# EAGLE schematic ElektorLinuxBoard_V3.01 (EAGLE 6.4)

## Sheet 1 of 3
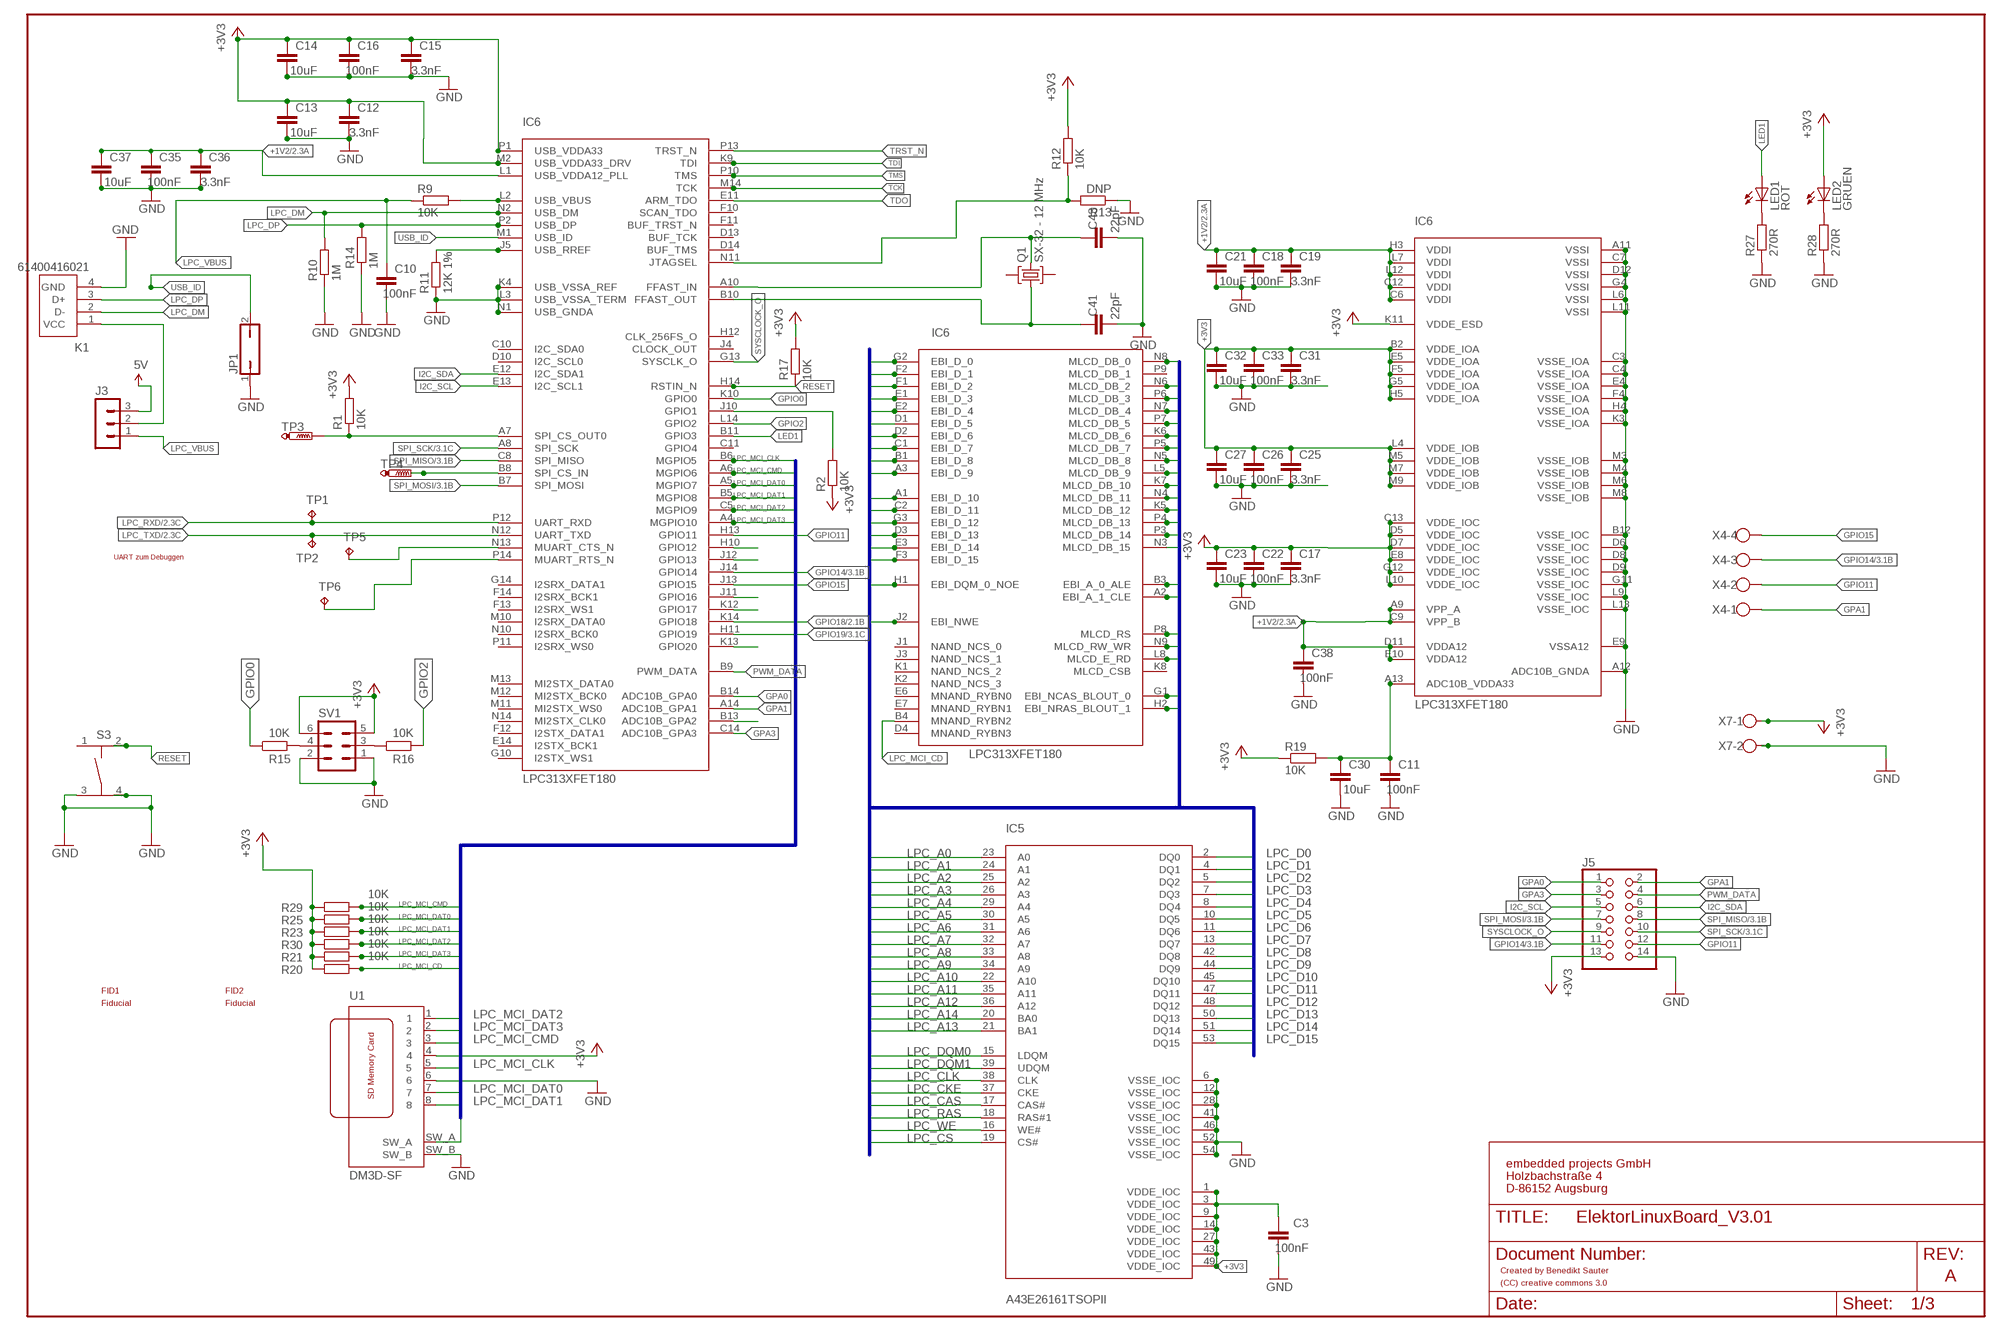
[diagram p0: schematic, sheet 1]

### Parts
C3  100nF  C-EUC0805  [C0805]
C10  100nF  C-EUC0805  [C0805]
C11  100nF  C-EUC0805  [C0805]
C12  3.3nF  C-EUC0805  [C0805]
C13  10uF  C-EUC0805  [C0805]
C14  10uF  C-EUC0805  [C0805]
C15  3.3nF  C-EUC0805  [C0805]
C16  100nF  C-EUC0805  [C0805]
C17  3.3nF  C-EUC0805  [C0805]
C18  100nF  C-EUC0805  [C0805]
C19  3.3nF  C-EUC0805  [C0805]
C21  10uF  C-EUC0805  [C0805]
C22  100nF  C-EUC0805  [C0805]
C23  10uF  C-EUC0805  [C0805]
C25  3.3nF  C-EUC0805  [C0805]
C26  100nF  C-EUC0805  [C0805]
C27  10uF  C-EUC0805  [C0805]
C30  10uF  C-EUC0805  [C0805]
C31  3.3nF  C-EUC0805  [C0805]
C32  10uF  C-EUC0805  [C0805]
C33  100nF  C-EUC0805  [C0805]
C35  100nF  C-EUC0805  [C0805]
C36  3.3nF  C-EUC0805  [C0805]
C37  10uF  C-EUC0805  [C0805]
C38  100nF  C-EUC0805  [C0805]
C41  22pF  C-EUC0805  [C0805]
C43  22pF  C-EUC0805  [C0805]
FID1  PASSERMARKEN_FIDUCIAL  [PASSERMARKEN_FIDUCIAL]
FID2  PASSERMARKEN_FIDUCIAL  [PASSERMARKEN_FIDUCIAL]
IC5  A43E26161TSOPII  [TSOPII]
IC6  LPC313XFET180  [TFBGA180]
J3  MA03-1  [MA03-1]
J5  PINHD-2X7  [2X07]
JP1  JP1Q  [JP1]
K1  61400416021  [61400416021]
LED1  ROT  LEDCHIP-LED0805  [CHIP-LED0805]
LED2  GRUEN  LEDCHIP-LED0805  [CHIP-LED0805]
Q1  SX-32 - 12 MHz  SX-32  [SX-32]
R1  10K  R-EU_R0805  [R0805]
R2  10K  R-EU_R0805  [R0805]
R9  10K  R-EU_R0805  [R0805]
R10  1M  R-EU_R0805  [R0805]
R11  12K 1%  R-EU_R0805  [R0805]
R12  10K  R-EU_R0805  [R0805]
R13  DNP  R-EU_R0805  [R0805]
R14  1M  R-EU_R0805  [R0805]
R15  10K  R-EU_R0805  [R0805]
R16  10K  R-EU_R0805  [R0805]
R17  10K  R-EU_R0805  [R0805]
R19  10K  R-EU_R0805  [R0805]
R20  10K  R-EU_R0805  [R0805]
R21  10K  R-EU_R0805  [R0805]
R23  10K  R-EU_R0805  [R0805]
R25  10K  R-EU_R0805  [R0805]
R27  270R  R-EU_R0805  [R0805]
R28  270R  R-EU_R0805  [R0805]
R29  10K  R-EU_R0805  [R0805]
R30  10K  R-EU_R0805  [R0805]
S3  TASTER-9314_SMD  [TASTER-9314_SMD]
SV1  MA03-2  [MA03-2]
TP1  TPTP15R  [TP15R]
TP2  TPTP15R  [TP15R]
TP3  PTR1TP08R  [TP08R]
TP4  PTR1TP08R  [TP08R]
TP5  TPTP08R  [TP08R]
TP6  TPTP08R  [TP08R]
U1  DM3D-SF  [DM3D-SF]
X4  W237-04P  [W237-4P]
X7  W237-02P  [W237-132]

### Nets
5V [500mA]: J3.3 ; also sheet 2
+1V2: C18.2 C19.2 C21.2 C35.2 C36.2 C37.2 C38.2 IC6.A9(VPP_A) IC6.C6(VDDI) IC6.C9(VPP_B) IC6.C12(VDDI) IC6.D11(VDDA12) IC6.E10(VDDA12) IC6.H3(VDDI) IC6.L1(USB_VDDA12_PLL) IC6.L7(VDDI) IC6.L12(VDDI) ; also sheet 2
+3V3: C3.2 C12.2 C13.2 C14.2 C15.2 C16.2 C17.2 C22.2 C23.2 C25.2 C26.2 C27.2 C31.2 C32.2 C33.2 IC5.1(VDDE_IOC) IC5.3(VDDE_IOC) IC5.9(VDDE_IOC) IC5.14(VDDE_IOC) IC5.27(VDDE_IOC) IC5.43(VDDE_IOC) IC5.49(VDDE_IOC) IC6.B2(VDDE_IOA) IC6.C13(VDDE_IOC) IC6.D5(VDDE_IOC) IC6.D7(VDDE_IOC) IC6.E5(VDDE_IOA) IC6.E8(VDDE_IOC) IC6.F5(VDDE_IOA) IC6.G5(VDDE_IOA) IC6.G12(VDDE_IOC) IC6.H5(VDDE_IOA) IC6.K11(VDDE_ESD) IC6.L4(VDDE_IOB) IC6.L10(VDDE_IOC) IC6.M2(USB_VDDA33_DRV) IC6.M5(VDDE_IOB) IC6.M7(VDDE_IOB) IC6.M9(VDDE_IOB) IC6.P1(USB_VDDA33) J5.13 LED2.A R1.2 R2.1 R12.2 R17.2 R19.1 R20.1 R21.1 R23.1 R25.1 R29.1 R30.1 SV1.5 SV1.6 U1.4 X7.1 ; also sheet 2,3
GND: C3.1 C10.1 C11.1 C12.1 C13.1 C14.1 C15.1 C16.1 C17.1 C18.1 C19.1 C21.1 C22.1 C23.1 C25.1 C26.1 C27.1 C30.1 C31.1 C32.1 C33.1 C35.1 C36.1 C37.1 C38.1 C41.1 C43.1 IC5.6(VSSE_IOC) IC5.12(VSSE_IOC) IC5.28(VSSE_IOC) IC5.41(VSSE_IOC) IC5.46(VSSE_IOC) IC5.52(VSSE_IOC) IC5.54(VSSE_IOC) IC6.A11(VSSI) IC6.A12(ADC10B_GNDA) IC6.B12(VSSE_IOC) IC6.C3(VSSE_IOA) IC6.C4(VSSE_IOA) IC6.C7(VSSI) IC6.D6(VSSE_IOC) IC6.D8(VSSE_IOC) IC6.D9(VSSE_IOC) IC6.D12(VSSI) IC6.E4(VSSE_IOA) IC6.E9(VSSA12) IC6.F4(VSSE_IOA) IC6.G4(VSSI) IC6.G11(VSSE_IOC) IC6.H4(VSSE_IOA) IC6.K3(VSSE_IOA) IC6.K4(USB_VSSA_REF) IC6.L3(USB_VSSA_TERM) IC6.L6(VSSI) IC6.L9(VSSE_IOC) IC6.L11(VSSI) IC6.L13(VSSE_IOC) IC6.M3(VSSE_IOB) IC6.M4(VSSE_IOB) IC6.M6(VSSE_IOB) IC6.M8(VSSE_IOB) IC6.N1(USB_GNDA) J5.14 JP1.1 K1.4(GND) R10.1 R11.1 R13.1 R14.1 R27.1 R28.1 S3.3 S3.4 SV1.1 SV1.2 U1.6 U1.SW_B X7.2 ; also sheet 2,3
GPA0: IC6.B14(ADC10B_GPA0) J5.1
GPA1: IC6.A14(ADC10B_GPA1) J5.2 X4.1
GPA3: IC6.C14(ADC10B_GPA3) J5.3
GPIO0: IC6.K10(GPIO0) R15.1
GPIO2: IC6.L14(GPIO2) R16.2
GPIO11: IC6.H13(GPIO11) J5.12 X4.2
GPIO14: IC6.J14(GPIO14) J5.11 X4.3 ; also sheet 3
GPIO15: IC6.J13(GPIO15) X4.4
GPIO18: IC6.K14(GPIO18) ; also sheet 2
GPIO19: IC6.H11(GPIO19) ; also sheet 3
I2C_SCL: IC6.E13(I2C_SCL1) J5.5
I2C_SDA: IC6.E12(I2C_SDA1) J5.6
LED1: IC6.B11(GPIO3) LED1.A
LPC_A0: IC5.23(A0) IC6.B3(EBI_A_0_ALE)
LPC_A1: IC5.24(A1) IC6.A2(EBI_A_1_CLE)
LPC_A2: IC5.25(A2) IC6.N6(MLCD_DB_2)
LPC_A3: IC5.26(A3) IC6.P6(MLCD_DB_3)
LPC_A4: IC5.29(A4) IC6.N7(MLCD_DB_4)
LPC_A5: IC5.30(A5) IC6.P7(MLCD_DB_5)
LPC_A6: IC5.31(A6) IC6.K6(MLCD_DB_6)
LPC_A7: IC5.32(A7) IC6.P5(MLCD_DB_7)
LPC_A8: IC5.33(A8) IC6.N5(MLCD_DB_8)
LPC_A9: IC5.34(A9) IC6.L5(MLCD_DB_9)
LPC_A10: IC5.22(A10) IC6.K7(MLCD_DB_10)
LPC_A11: IC5.35(A11) IC6.N4(MLCD_DB_11)
LPC_A12: IC5.36(A12) IC6.K5(MLCD_DB_12)
LPC_A13: IC5.21(BA1) IC6.P4(MLCD_DB_13)
LPC_A14: IC5.20(BA0) IC6.P3(MLCD_DB_14)
LPC_A15: IC6.N3(MLCD_DB_15)
LPC_CAS: IC5.17(CAS#) IC6.G1(EBI_NCAS_BLOUT_0)
LPC_CKE: IC5.37(CKE) IC6.L8(MLCD_E_RD)
LPC_CLK: IC5.38(CLK) IC6.N8(MLCD_DB_0)
LPC_CS: IC5.19(CS#) IC6.P8(MLCD_RS)
LPC_D0: IC5.2(DQ0) IC6.G2(EBI_D_0)
LPC_D1: IC5.4(DQ1) IC6.F2(EBI_D_1)
LPC_D2: IC5.5(DQ2) IC6.F1(EBI_D_2)
LPC_D3: IC5.7(DQ3) IC6.E1(EBI_D_3)
LPC_D4: IC5.8(DQ4) IC6.E2(EBI_D_4)
LPC_D5: IC5.10(DQ5) IC6.D1(EBI_D_5)
LPC_D6: IC5.11(DQ6) IC6.D2(EBI_D_6)
LPC_D7: IC5.13(DQ7) IC6.C1(EBI_D_7)
LPC_D8: IC5.42(DQ8) IC6.B1(EBI_D_8)
LPC_D9: IC5.44(DQ9) IC6.A3(EBI_D_9)
LPC_D10: IC5.45(DQ10) IC6.A1(EBI_D_10)
LPC_D11: IC5.47(DQ11) IC6.C2(EBI_D_11)
LPC_D12: IC5.48(DQ12) IC6.G3(EBI_D_12)
LPC_D13: IC5.50(DQ13) IC6.D3(EBI_D_13)
LPC_D14: IC5.51(DQ14) IC6.E3(EBI_D_14)
LPC_D15: IC5.53(DQ15) IC6.F3(EBI_D_15)
LPC_DM: IC6.N2(USB_DM) K1.2(D-) R10.2
LPC_DP: IC6.P2(USB_DP) K1.3(D+) R14.2
LPC_DQM0: IC5.15(LDQM) IC6.H1(EBI_DQM_0_NOE)
LPC_DQM1: IC5.39(UDQM) IC6.N9(MLCD_RW_WR)
LPC_MCI_CD: IC6.B4(MNAND_RYBN2) R20.2 U1.SW_A
LPC_MCI_CLK: IC6.B6(MGPIO5) U1.5
LPC_MCI_CMD: IC6.A6(MGPIO6) R29.2 U1.3
LPC_MCI_DAT0: IC6.A5(MGPIO7) R25.2 U1.7
LPC_MCI_DAT1: IC6.B5(MGPIO8) R23.2 U1.8
LPC_MCI_DAT2: IC6.C5(MGPIO9) R30.2 U1.1
LPC_MCI_DAT3: IC6.A4(MGPIO10) R21.2 U1.2
LPC_RAS: IC5.18(RAS#1) IC6.H2(EBI_NRAS_BLOUT_1)
LPC_RXD: IC6.P12(UART_RXD) TP1.TP ; also sheet 2
LPC_TXD: IC6.N12(UART_TXD) TP2.TP ; also sheet 2
LPC_VBUS: C10.2 J3.1 R9.1
LPC_WE: IC5.16(WE#) IC6.J2(EBI_NWE)
N$3: LED1.C R27.2
N$7: LED2.C R28.2
N$9: IC6.N11(JTAGSEL) R12.1 R13.2
N$10: J3.2 K1.1(VCC)
N$16: IC6.K13(GPIO20)
N$18: IC6.A7(SPI_CS_OUT0) R1.1 TP3.TP
N$19: IC6.B8(SPI_CS_IN) TP4.TP
N$20: IC6.K12(GPIO17)
N$21: IC6.J11(GPIO16)
N$22: IC6.B13(ADC10B_GPA2)
N$24: IC6.J12(GPIO13)
N$25: IC6.H10(GPIO12)
N$26: IC6.J10(GPIO1) R2.2
N$27: R15.2 SV1.4
N$28: R16.1 SV1.3
N$29: IC6.N13(MUART_CTS_N) TP5.TP
N$30: IC6.P14(MUART_RTS_N) TP6.TP
N$44: C11.2 C30.2 IC6.A13(ADC10B_VDDA33) R19.2
N$54: IC6.J5(USB_RREF) R11.2
N$57: IC6.L2(USB_VBUS) R9.2
PWM_DATA: IC6.B9(PWM_DATA) J5.4
RESET: IC6.H14(RSTIN_N) R17.1 S3.2
SPI_MISO: IC6.C8(SPI_MISO) J5.8 ; also sheet 3
SPI_MOSI: IC6.B7(SPI_MOSI) J5.7 ; also sheet 3
SPI_SCK: IC6.A8(SPI_SCK) J5.10 ; also sheet 3
SYSCLOCK_O: IC6.G13(SYSCLK_O) J5.9
TCK: IC6.M14(TCK)
TDI: IC6.K9(TDI)
TDO: IC6.E11(ARM_TDO)
TMS: IC6.P10(TMS)
TRST_N: IC6.P13(TRST_N)
USB_ID: IC6.M1(USB_ID) JP1.2
XTAL1: C43.2 IC6.A10(FFAST_IN) Q1.3
XTAL2: C41.2 IC6.B10(FFAST_OUT) Q1.1
Unconnected: IC6.C10(I2C_SDA0) IC6.C11(GPIO4) IC6.D4(MNAND_RYBN3) IC6.D10(I2C_SCL0) IC6.D13(BUF_TCK) IC6.D14(BUF_TMS) IC6.E6(MNAND_RYBN0) IC6.E7(MNAND_RYBN1) IC6.E14(I2STX_BCK1) IC6.F10(SCAN_TDO) IC6.F11(BUF_TRST_N) IC6.F12(I2STX_DATA1) IC6.F13(I2SRX_WS1) IC6.F14(I2SRX_BCK1) IC6.G10(I2STX_WS1) IC6.G14(I2SRX_DATA1) IC6.H12(CLK_256FS_O) IC6.J1(NAND_NCS_0) IC6.J3(NAND_NCS_1) IC6.J4(CLOCK_OUT) IC6.K1(NAND_NCS_2) IC6.K2(NAND_NCS_3) IC6.K8(MLCD_CSB) IC6.M10(I2SRX_DATA0) IC6.M11(MI2STX_WS0) IC6.M12(MI2STX_BCK0) IC6.M13(MI2STX_DATA0) IC6.N10(I2SRX_BCK0) IC6.N14(MI2STX_CLK0) IC6.P9(MLCD_DB_1) IC6.P11(I2SRX_WS0) Q1.2 Q1.4 S3.1

### Buses
B3:LPC_D0,LPC_D1,LPC_D2,LPC_D3,LPC_D4,LPC_D5,LPC_D6,LPC_D7,LPC_D8,LPC_D9,LPC_D10,LPC_D11,LPC_D12,LPC_D13,LPC_D14,LPC_D15,LPC_A0,LPC_A1,LPC_A2,LPC_A3,LPC_A4,LPC_A5,LPC_A6,LPC_A7,LPC_A8,LPC_A9,LPC_A10,LPC_A11,LPC_A12,LPC_A13,LPC_A14,LPC_A15,LPC_CKE,LPC_CS,LPC_DQM1,LPC_CLK,LPC_RAS,LPC_CAS,LPC_DQM0,LPC_WE
B5:LPC_MCI_CLK,LPC_MCI_CMD,LPC_MCI_DAT0,LPC_MCI_DAT1,LPC_MCI_DAT2,LPC_MCI_DAT3,LPC_MCI_CD,LPC_MCI_WP

### Notes on the sheet
- UART zum Debuggen
- embedded projects GmbH
- Holzbachstraße 4
- D-86152 Augsburg
- Created by Benedikt Sauter
- A
- (CC) creative commons 3.0

## Sheet 2 of 3
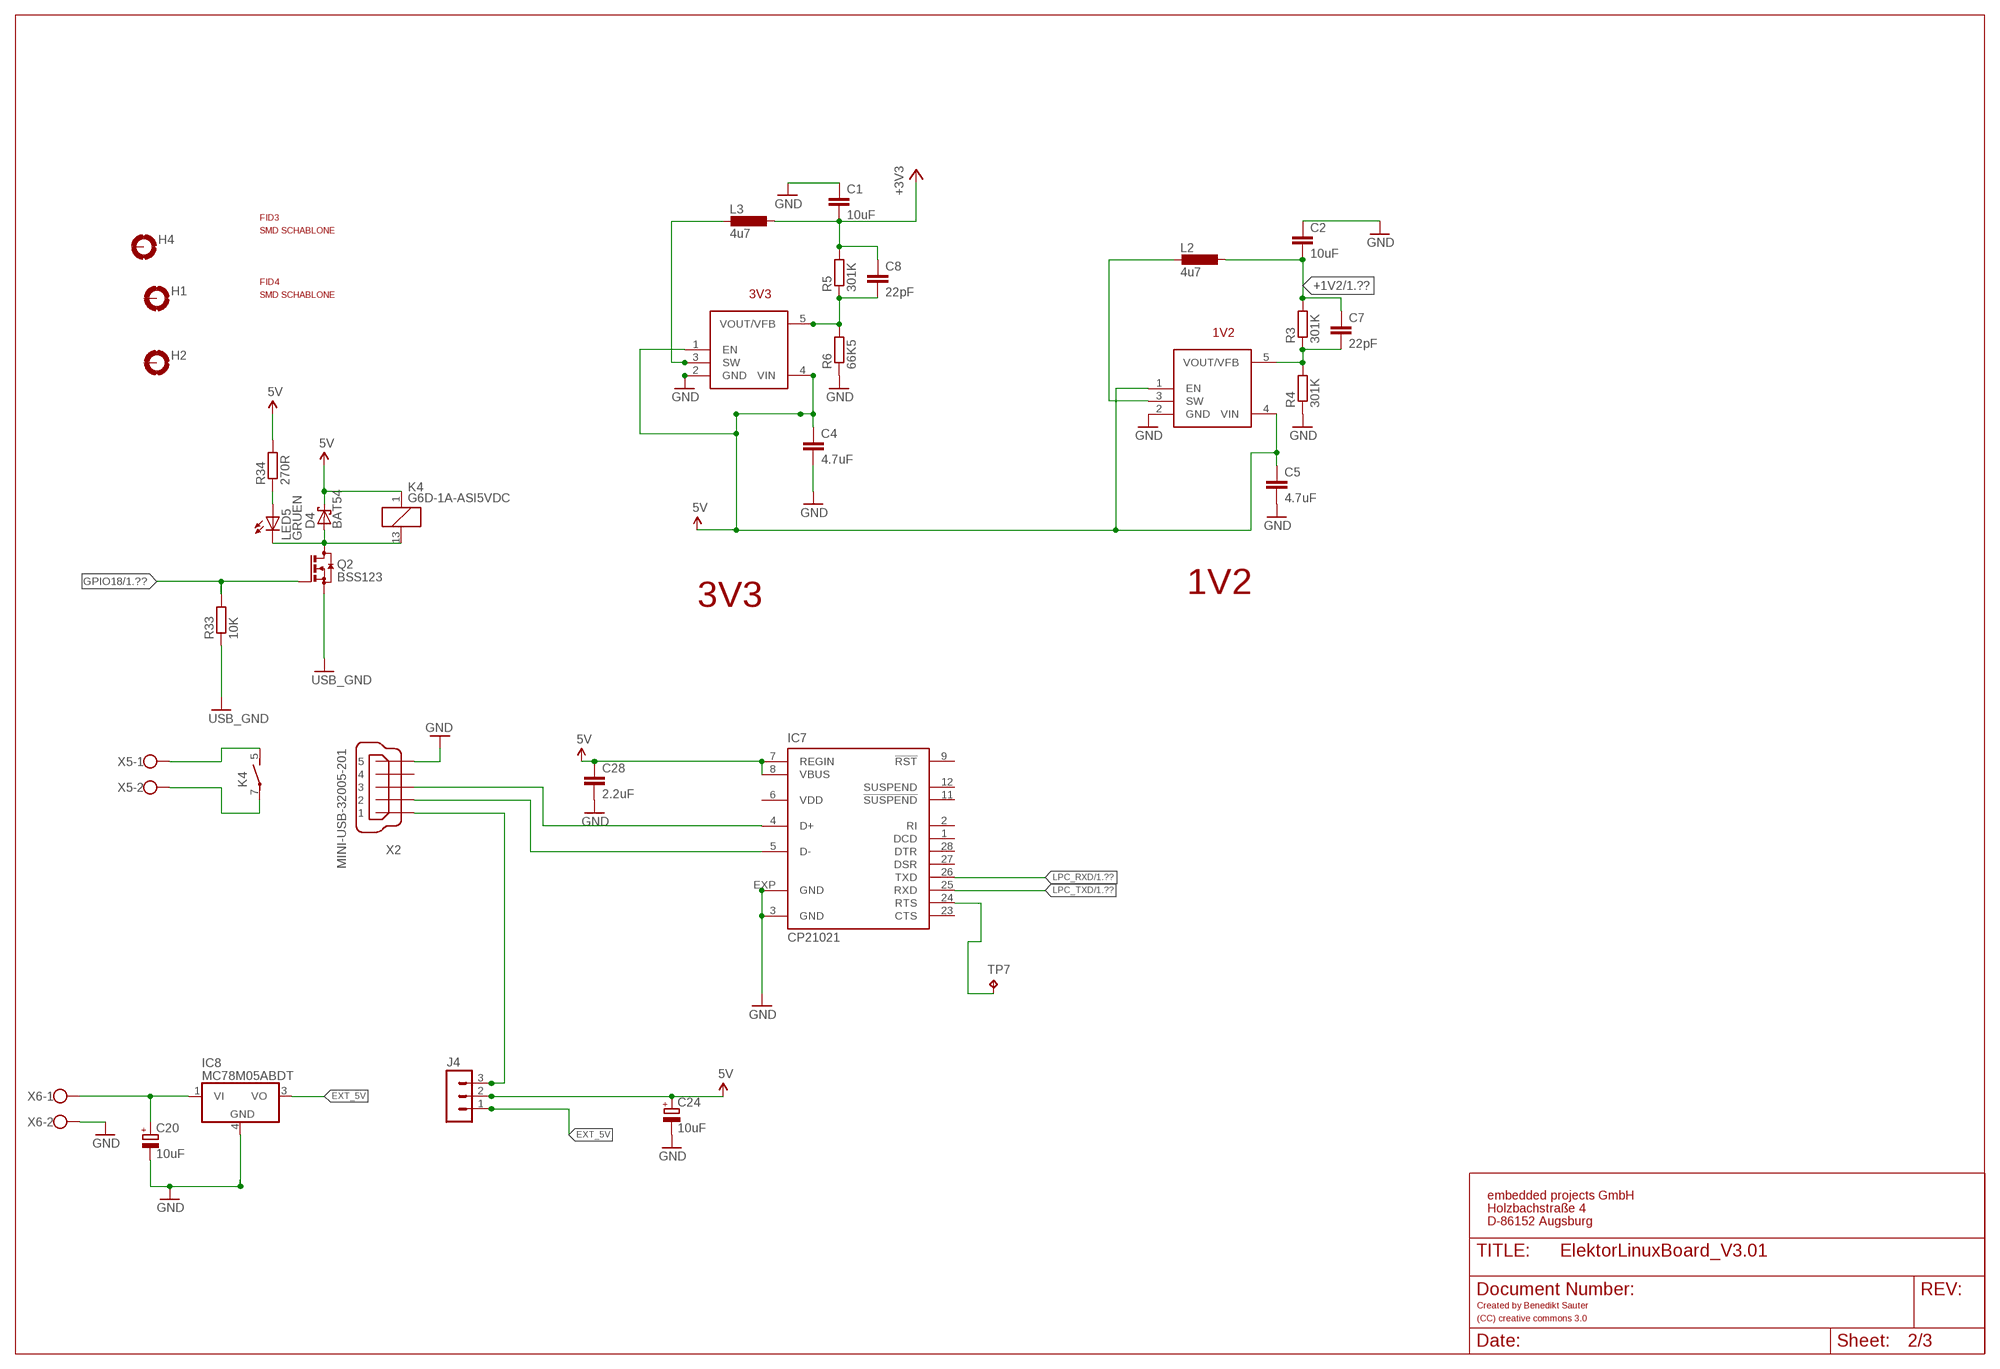
[diagram p1: schematic, sheet 2]

### Parts
C1  10uF  C-EUC0805  [C0805]
C2  10uF  C-EUC0805  [C0805]
C4  4.7uF  C-EUC0805  [C0805]
C5  4.7uF  C-EUC0805  [C0805]
C7  22pF  C-EUC0805  [C0805]
C8  22pF  C-EUC0805  [C0805]
C20  10uF  CPOL-EUD/7343-31R  [D/7343-31R]
C24  10uF  CPOL-EUD/7343-31R  [D/7343-31R]
C28  2.2uF  C-EUC0805  [C0805]
D4  BAT54  DIODE_BAT54  [DIODE_SOT23]
FID3  PASSERMARKEN_FIDUCIAL  [PASSERMARKEN_FIDUCIAL]
FID4  PASSERMARKEN_FIDUCIAL  [PASSERMARKEN_FIDUCIAL]
H1  MOUNT-PAD-ROUND2.8  [2,8-PAD]
H2  MOUNT-PAD-ROUND2.8  [2,8-PAD]
H4  MOUNT-PAD-ROUND2.8  [2,8-PAD]
IC2  AS1324  [TSOT23]
IC3  AS1324  [TSOT23]
IC7  CP21021  [MLP28]
IC8  MC78M05ABDT  [DPACK_3]
J4  MA03-1  [MA03-1]
K4  G6D-1A-ASI5VDC  RELAY_G6D-1A-ASI5VDC  [RELAY_G6D]
L2  4u7  PSU3014  [PSU3014]
L3  4u7  PSU3014  [PSU3014]
LED5  GRUEN  LEDCHIP-LED0805  [CHIP-LED0805]
Q2  BSS123  TRANSISTOR-SMALL-SIGNAL_BSS123  [TRANSISTOR-SMALL-SIGNAL_SOT23]
R3  301K  R-EU_R0805  [R0805]
R4  301K  R-EU_R0805  [R0805]
R5  301K  R-EU_R0805  [R0805]
R6  66K5  R-EU_R0805  [R0805]
R33  10K  R-EU_R0805  [R0805]
R34  270R  R-EU_R0805  [R0805]
TP7  TPTP08R  [TP08R]
X2  MINI-USB-32005-201  [32005-201]
X5  W237-02P  [W237-132]
X6  W237-02P  [W237-132]

### Nets
5V [500mA]: C4.1 C5.1 C24.+ C28.1 D4.3(C) IC2.1(EN) IC2.4(VIN) IC3.1(EN) IC3.4(VIN) IC7.7(REGIN) IC7.8(VBUS) J4.2 K4.1 R34.2 ; also sheet 1
+1V2: C2.2 C7.1 L2.2 R3.2 ; also sheet 1
+3V3: C1.2 C8.1 L3.2 R5.2 ; also sheet 1,3
EXT_5V: IC8.3(VO) J4.1
GND: C1.1 C2.1 C4.2 C5.2 C20.- C24.- C28.2 IC2.2(GND) IC3.2(GND) IC7.3(GND) IC7.EXP(GND) IC8.4(GND) Q2.2(S) R4.1 R6.1 R33.1 X2.5 X6.2 ; supply symbol labelled USB_GND ; also sheet 1,3
GPIO18: Q2.1(G) R33.2 ; also sheet 1
LPC_RXD: IC7.26(TXD) ; also sheet 1
LPC_TXD: IC7.25(RXD) ; also sheet 1
N$4: IC7.4(D+) X2.3
N$5: IC7.5(D-) X2.2
N$8: IC2.3(SW) L2.1
N$17: J4.3 X2.1
N$23: IC7.24(RTS) TP7.TP
N$37: D4.1(A) K4.13 LED5.C Q2.3(D)
N$38: C7.2 IC2.5(VOUT/VFB) R3.1 R4.2
N$39: LED5.A R34.1
N$40: K4.5(2:S) X5.1
N$67: IC3.3(SW) L3.1
N$81: C20.+ IC8.1(VI) X6.1
N$132: C8.2 IC3.5(VOUT/VFB) R5.1 R6.2
RIGHT: K4.7(2:P) X5.2
Unconnected: H1.B2,8(MOUNT) H2.B2,8(MOUNT) H4.B2,8(MOUNT) IC7.1(DCD) IC7.2(RI) IC7.9(!RST) IC7.11(!SUSPEND) IC7.12(SUSPEND) IC7.23(CTS) IC7.27(DSR) IC7.28(DTR) X2.4

### Notes on the sheet
- 3V3
- 1V2
- 1V2
- 3V3
- embedded projects GmbH
- Holzbachstraße 4
- D-86152 Augsburg
- Created by Benedikt Sauter
- (CC) creative commons 3.0

## Sheet 3 of 3
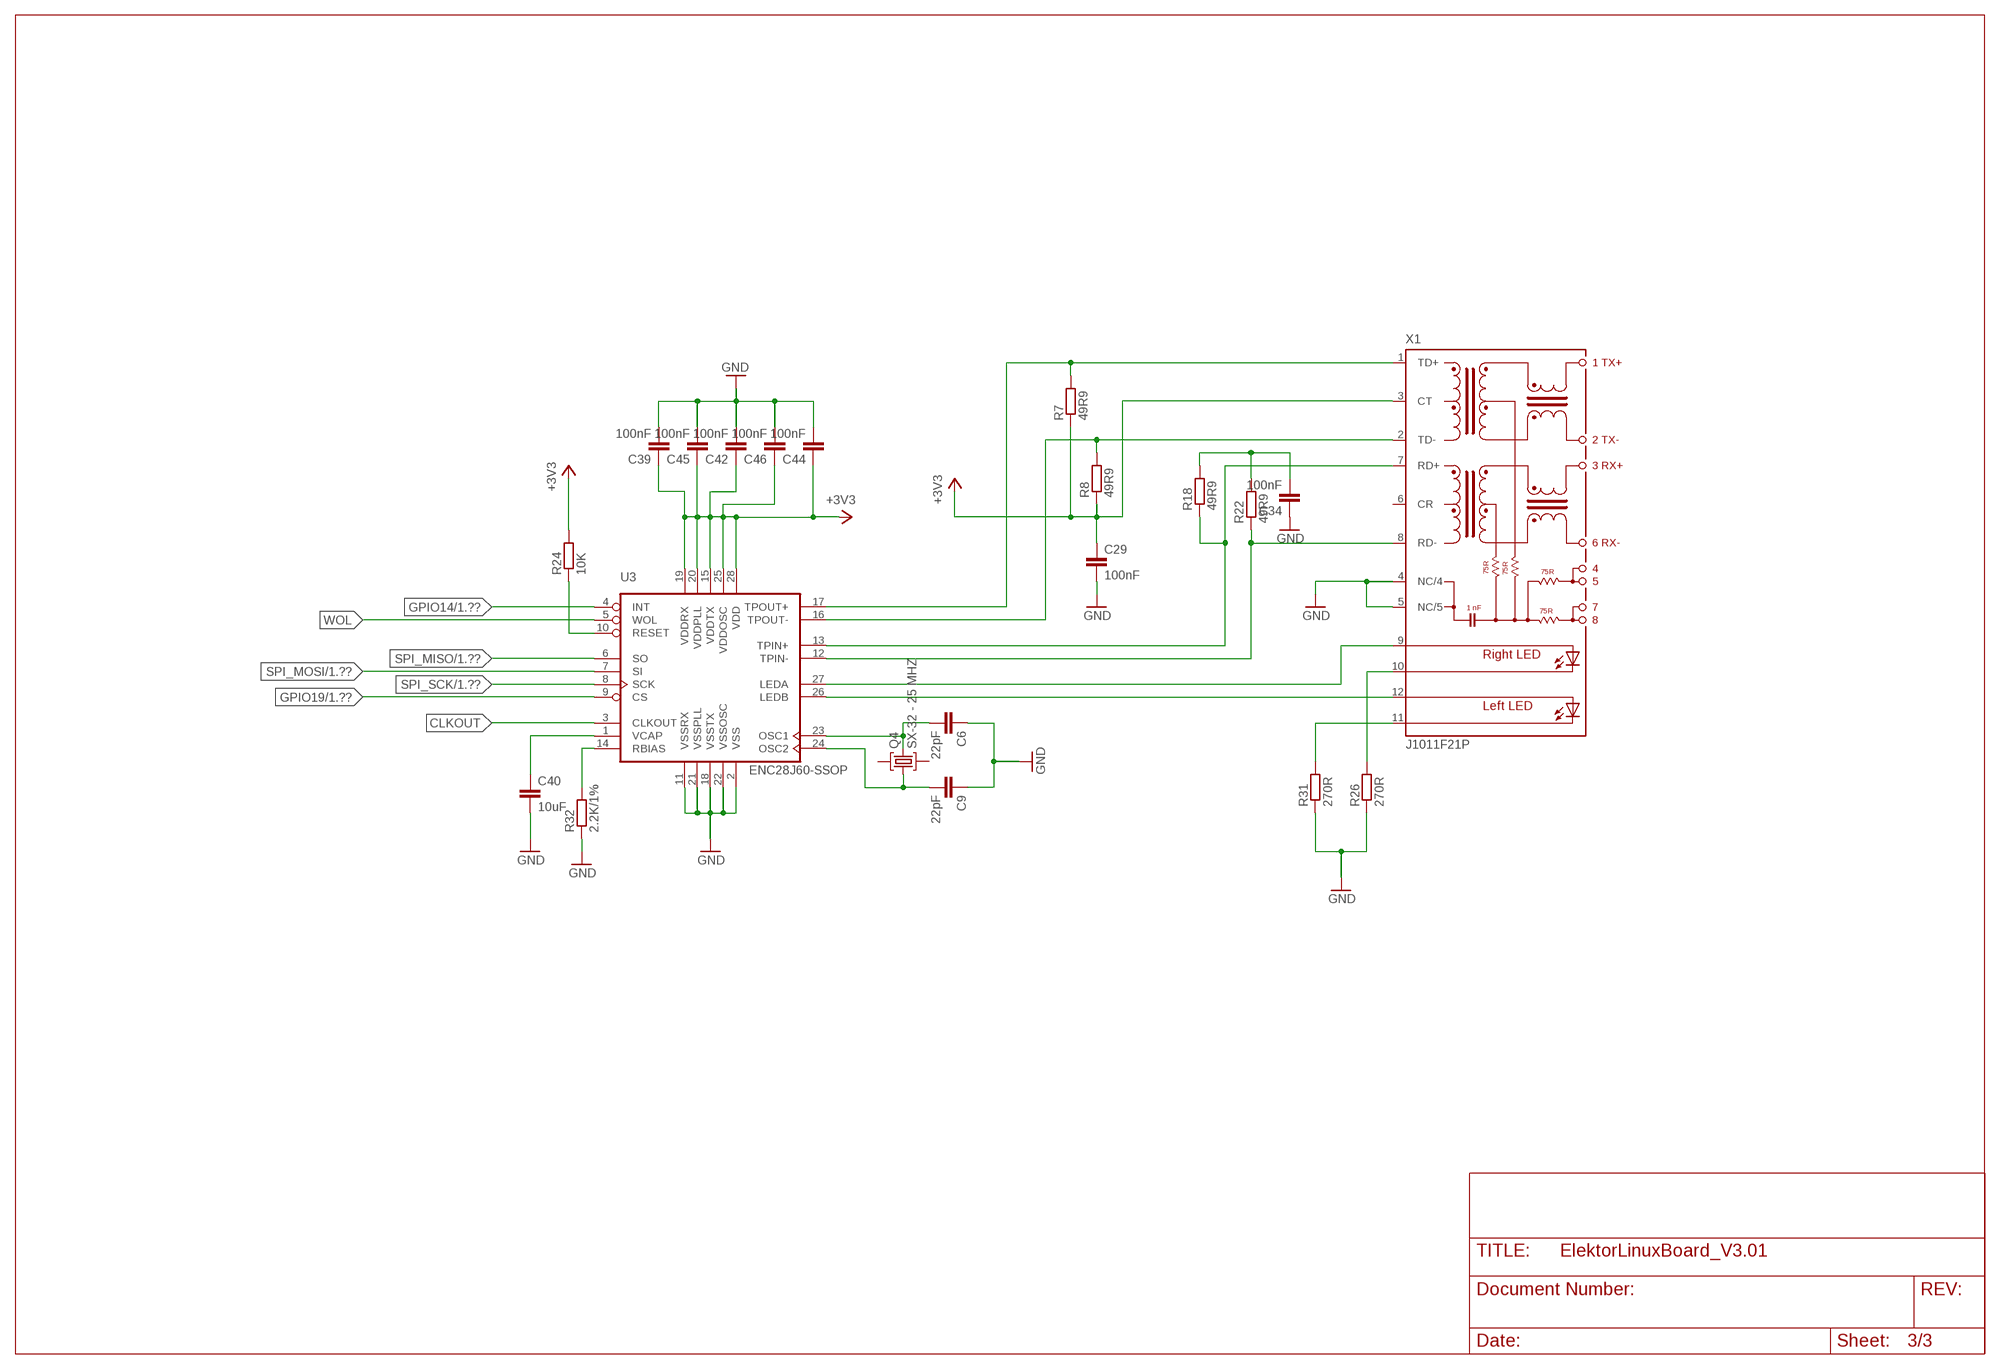
[diagram p2: schematic, sheet 3]

### Parts
C6  22pF  C-EUC0805  [C0805]
C9  22pF  C-EUC0805  [C0805]
C29  100nF  C-EUC0805  [C0805]
C34  100nF  C-EUC0805  [C0805]
C39  100nF  C-EUC0805  [C0805]
C40  10uF  C-EUC0805  [C0805]
C42  100nF  C-EUC0805  [C0805]
C44  100nF  C-EUC0805  [C0805]
C45  100nF  C-EUC0805  [C0805]
C46  100nF  C-EUC0805  [C0805]
Q4  SX-32 - 25 MHZ  SX-32  [SX-32]
R7  49R9  R-EU_R0805  [R0805]
R8  49R9  R-EU_R0805  [R0805]
R18  49R9  R-EU_R0805  [R0805]
R22  49R9  R-EU_R0805  [R0805]
R24  10K  R-EU_R0805  [R0805]
R26  270R  R-EU_R0805  [R0805]
R31  270R  R-EU_R0805  [R0805]
R32  2.2K/1%  R-EU_R0805  [R0805]
U3  ENC28J60-SSOP  [SSOP28]
X1  J1011F21P  [J1]

### Nets
+3V3: C29.1 C39.1 C42.1 C44.1 C45.1 C46.1 R7.1 R8.1 R24.2 U3.15(VDDTX) U3.19(VDDRX) U3.20(VDDPLL) U3.25(VDDOSC) U3.28(VDD) X1.3(CT) ; also sheet 1,2
CLKOUT: U3.3(CLKOUT)
GND: C6.1 C9.1 C29.2 C34.1 C39.2 C40.2 C42.2 C44.2 C45.2 C46.2 R26.1 R31.1 R32.1 U3.2(VSS) U3.11(VSSRX) U3.18(VSSTX) U3.21(VSSPLL) U3.22(VSSOSC) X1.4(NC/4) X1.5(NC/5) ; also sheet 1,2
GPIO14: U3.4(INT) ; also sheet 1
GPIO19: U3.9(CS) ; also sheet 1
LINKACT: R26.2 X1.10(C-R)
N$1: C34.2 R18.2 R22.2
N$14: R24.1 U3.10(RESET)
N$15: C40.1 U3.1(VCAP)
N$31: U3.27(LEDA) X1.9(A-R)
N$32: R32.2 U3.14(RBIAS)
N$33: U3.26(LEDB) X1.12(AL)
RX+: R18.1 U3.13(TPIN+) X1.7(RD+)
RX-: R22.1 U3.12(TPIN-) X1.8(RD-)
SPEED: R31.2 X1.11(C-L)
SPI_MISO: U3.6(SO) ; also sheet 1
SPI_MOSI: U3.7(SI) ; also sheet 1
SPI_SCK: U3.8(SCK) ; also sheet 1
TX+: R7.2 U3.17(TPOUT+) X1.1(TD+)
TX-: R8.2 U3.16(TPOUT-) X1.2(TD-)
WOL: U3.5(WOL)
XT1: C9.2 Q4.1 U3.24(OSC2)
XT2: C6.2 Q4.3 U3.23(OSC1)
Unconnected: Q4.2 Q4.4 X1.6(CR)

## Power pins joined to a net without a drawn wire
VDD: IC7.6(VDD)

## Library data of the parts
C1-C19 C21-C23 C25-C46 = rcl:C-EU: CAPACITOR, European symbol
C20 C24 = rcl:CPOL-EU: POLARIZED CAPACITOR, European symbol
D4 = 20110426_ECP_XMEGABOARD_V102:DIODE_BAT54: Schottky Diodes Source: Fairchild .. BAT54.pdf
FID1 FID2 = KUBUS3:PASSERMARKEN_FIDUCIAL: SMD Passermarke
FID3 FID4 = SMDSCHABLONE:PASSERMARKEN_FIDUCIAL: SMD Passermarke
H1 H2 H4 = holes:MOUNT-PAD-ROUND: MOUNTING PAD, round
IC2 IC3 = KUBUS3B_PARTS2:AS1324: DC/DC Step-Down Regulator
IC5 = LPC3131:A43E26161
IC6 = KUBUS3B:LPC313XFET180: lpc313x.lpc314x.tfbga edit this description Auto generated by make-symbol-device-package-bsdl.ulp Rev. 24 Source: lpc313x.lpc314x.tfbga.bsdl
IC7 = CP2102:CP2102: Single-Chip USB to UART Bridge Source: www.silabs.com .. CP2101.pdf / cp2102.pdf; MF: FARNELL; MPN: CP2102-GM; OC_FARNELL: 9282130; OC_NEWARK: 30K5635
IC8 = linear:MC78M: 500 mA Positive Voltage Regulators Source: Data sheet <http://www.onsemi.com/pub_link/Collateral/MC78M00-D.PDF>
J3 J4 = con-lstb:MA03-1: PIN HEADER
J5 = pinhead:PINHD-2X7: PIN HEADER
JP1 = jumper:JP1Q: JUMPER
K1 = Wuerth_Elektronik_eiCan_11_Communication_Connectors_1_2:61400416021: WR-COM Horizontal USB Type A
K4 = 20110426_ECP_XMEGABOARD_V102:RELAY_G6D?*: OMRON Slim, Miniature PCB Relay 17.5 × 6.5 × 12.5 mm with Socked Source: http://ecb.omron.com.sg/pdf/relay/power/G6D.pdf; OC_FARNELL: 9812660; OC_NEWARK: unknown
L2 L3 = KUBUS3B_PARTS2:PSU3014: SMD Power Inductors Shielded
LED1 LED2 LED5 = led:LED: LED OSRAM: - CHIPLED LG R971, LG N971, LY N971, LG Q971, LY Q971, LO R971, LY R971 LH N974, LH R974 LS Q976, LO Q976, LY Q976 LO Q996 - Hyper CHIPLED LW Q18S LB Q993, LB Q99A, LB R99A - SideLED LS A670, LO A670, LY A670, LG A670, LP A670 LB A673, LV A673, LT A673, LW A673 LH A674 LY A675 LS A676, LA A676, LO A676, LY A676, LW A676 LS A679, LY A679, LG A679 - Hyper Micro SIDELED® LS Y876, LA Y876, LO Y876, LY Y876 LT Y87S - SmartLED LW L88C, LW L88S LB L89C, LB L89S, LG L890 LS L89K, LO L89K, LY L89K LS L896, LA L896, LO L896, LY L896 - TOPLED LS T670, LO T670, LY T670, LG T670, LP T670 LSG T670, LSP T670, LSY T670, LOP T670, LYG T670 LG T671, LOG T671, LSG T671 LB T673, LV T673, LT T673, LW T673 LH T674 LS T676, LA T676, LO T676, LY T676, LB T676, LH T676, LSB T676, LW T676 LB T67C, LV T67C, LT T67C, LS T67K, LO T67K, LY T67K, LW E67C LS E67B, LA E67B, LO E67B, LY E67B, LB E67C, LV E67C, LT E67C LW T67C LS T679, LY T679, LG T679 LS T770, LO T770, LY T770, LG T770, LP T770 LB T773, LV T773, LT T773, LW T773 LH T774 LS E675, LA E675, LY E675, LS T675 LS T776, LA T776, LO T776, LY T776, LB T776 LHGB T686 LT T68C, LB T68C - Hyper Mini TOPLED® LB M676 - Mini TOPLED Santana® LG M470 LS M47K, LO M47K, LY M47K Source: http://www.osram.convergy.de LUXEON: - LUMILED® LXK2-PW12-R00, LXK2-PW12-S00, LXK2-PW14-U00, LXK2-PW14-V00 LXK2-PM12-R00, LXK2-PM12-S00, LXK2-PM14-U00 LXK2-PE12-Q00, LXK2-PE12-R00, LXK2-PE12-S00, LXK2-PE14-T00, LXK2-PE14-U00 LXK2-PB12-K00, LXK2-PB12-L00, LXK2-PB12-M00, LXK2-PB14-N00, LXK2-PB14-P00, LXK2-PB14-Q00 LXK2-PR12-L00, LXK2-PR12-M00, LXK2-PR14-Q00, LXK2-PR14-R00 LXK2-PD12-Q00, LXK2-PD12-R00, LXK2-PD12-S00 LXK2-PH12-R00, LXK2-PH12-S00 LXK2-PL12-P00, LXK2-PL12-Q00, LXK2-PL12-R00 Source: www.luxeon.com KINGBRIGHT: KA-3528ASYC Source: www.kingbright.com
Q1 Q4 = KUBUS3B_PARTS2:SX-32: SMD CRYSTAL; FARNELL: 1712841
Q2 = 20110426_ECP_XMEGABOARD_V102:TRANSISTOR-SMALL-SIGNAL_BSS123: N-CHANNEL MOS FET
R1-R6 R9-R17 R19-R21 R23 R25 R27-R30 R33 R34 = rcl:R-EU_: RESISTOR, European symbol
R7 R8 R18 R22 R24 R26 R31 R32 = resistor:R-EU_: RESISTOR, European symbol
S3 = Ergaenzung:TASTER-9314_SMD
SV1 = con-lstb:MA03-2: PIN HEADER; OC_FARNELL: unknown; OC_NEWARK: unknown
TP1 TP2 TP5-TP7 = testpad:TP: Test pad
TP3 TP4 = testpad:PTR1: TEST PIN
U1 = KUBUS3B_PARTS2:DM3D-SF: MicroSD Card
U3 = enc28j60:ENC28J60-*: Microchip 10Mbit Ethernet controller with SPI interface Improved SOIC28 layout (pads in 0.01 raster, pin1 slightly smaller). Pin 6 (SO) changed from Out (paralleling several Outs gives an error) to OC. Author: Profi from mikrocontroller.net - forum Date: 2006.0827; FARNELL: 1084620
X1 = con-pulse:J1011F: PULSEJACK (TM) 1x1 Tab-UP RJ45 10/100 Base-TX RJ45 1x1 Tab-UP with LEDs 8-pin (J1 series) and 6-pin (JP series) integrated magnetics connector, designed to support applications, such as ADSL modems, LAN-on-Motherboard, and Hub and Switches. Source: www.pulseeng.com .. PulseJack-J402.pdf; OC_FARNELL: unknown; OC_NEWARK: unknown
X2 = con-cypressindustries:MINI-USB-: MINI USB-B Conector Source: www.cypressindustries.com
X4 = con-wago-508:W237-04P: WAGO SREW CLAMP
X5-X7 = con-wago-508:W237-02P: WAGO SREW CLAMP

## Net classes
0 default: width 0.2 mm, drill 0.3 mm, clearance 0.2 mm
1 500mA: width 0.3 mm, drill 0.3 mm, clearance 0.15 mm